# Altium schematic sheet charging.SchDoc: Triumvi - Charging
size Letter; Author: Ye-Sheng Kuo; Revision: 11; SheetNumber: 6; SheetTotal: 10
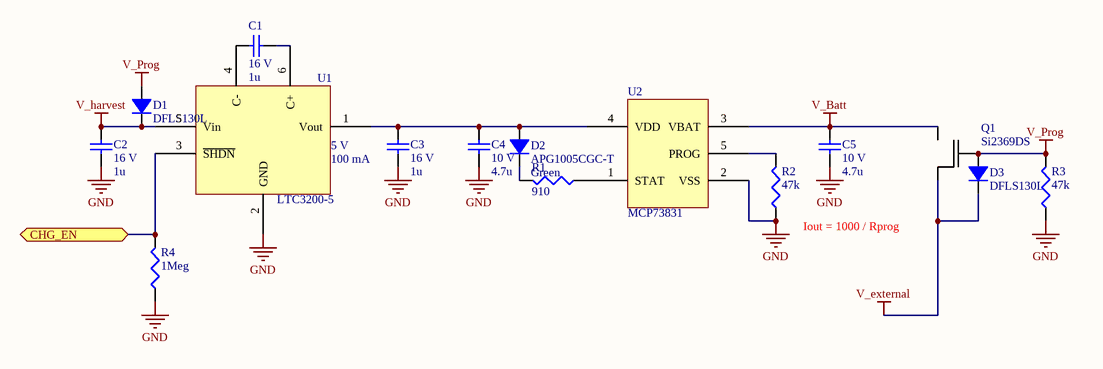
[diagram p0: charging.SchDoc]

## Parts
C1  voltage rated: 16 V  [0603]  (hidden comment: 1u)
C2  voltage rated: 16 V  [0603]  (hidden comment: 1u)
C3  voltage rated: 16 V  [0603]  (hidden comment: 1u)
C4  voltage rated: 10 V  [0603]  (hidden comment: 4.7u)
C5  voltage rated: 10 V  [0603]  (hidden comment: 4.7u)
D1  DFLS130L  [PowerDI123]
D2  APG1005CGC-T  value Green  [0402 - LED]
D3  DFLS130L  [PowerDI123]
Q1  Si2369DS  [SOT23-3]
R1  910  [0402]
R2  47k  [0402]
R3  47k  [0402]
R4  1Meg  [0402]
U1  LTC3200-5  Vout: 5 V  Iout: 100 mA  [SOT23-6]
U2  MCP73831  [TSOT23-5]

## Ports
CHG_EN

## Nets
GND: C2.1 C3.1 C4.2 C5.2 R2.2 R3.2 R4.2 U1.2(GND) U2.2(VSS)
V_Batt: C5.1 Q1.2(S) U2.3(VBAT)
V_external: D3.2 Q1.3(D)
V_harvest: C2.2 D1.2 U1.5(Vin)
V_Prog: D1.1 D3.1 Q1.1(G) R3.1
CHG_EN: R4.1 U1.3(~{SHDN}) ; port CHG_EN
NetC1_1: C1.1 U1.4(C-)
NetC1_2: C1.2 U1.6(C+)
NetC3_2: C3.2 C4.1 D2.1 U1.1(Vout) U2.4(VDD)
NetD2_2: D2.2 R1.1
NetR1_2: R1.2 U2.1(STAT)
NetR2_1: R2.1 U2.5(PROG)

## Notes on the sheet
- (near R2) Iout = 1000 / Rprog
- Title
- Date:
- Author:
- Revision:
- Sheet
- of
- University of Michigan
- File:

## Library data of the parts
C1-C3 = C1608X7R1C105K080AC: 1µF ±10% 16V Ceramic Capacitor X7R 0603; Manufacture: TDK; tolerance: 10%; package: 0603; Temperature Coefficient: X7R; Manufacturer Part Number: C1608X7R1C105K080AC; Supplier 1: Digi-Key; Supplier Part Number 1: 445-1604-1-ND; Value: 1u
C4 C5 = CGB3B1X5R1A475K055AC: 4.7µF ±10% 10V Ceramic Capacitor X5R 0603; Manufacture: TDK; tolerance: 10%; package: 0603; Supplier 1: Digi-Key; Supplier Part Number 1: 445-7482-1-ND; Value: 4.7u; Temperature Coefficient: X5R; Manufacturer Part Number: CGB3B1X5R1A475K055AC
D1 D3 = DFLS130L: 1.0A SURFACE MOUNT SCHOTTKY BARRIER RECTIFIER; Manufacturer: Diodes Incorporated; Forward Voltage @ If: 0.21 V @ 0.1 A; reverse current: 0.26 mA @ 5V; power: 556 mW; Manufacturer Part Number: DFLS130L; diode type: SCHOTTKY BARRIER; Supplier 1: Digi-Key; Supplier Part Number 1: DFLS130LDICT-ND
D2 = APG1005CGC-T: Green 571nm LED Indication - Discrete 2V 0402 (1005 Metric); Manufacturer: Kingbright; Current @ VF: 20 mA; package: 0402; Forward Voltage: 2 V; Manufacturer Part Number: APG1005CGC-T; Wavelength: 571 nm; Supplier 1: Digi-Key; Supplier Part Number 1: 754-1811-1-ND
Q1 = Si2369DS: P-Channel 30-V (D-S) MOSFET; Supplier 1: Digi-Key; Supplier Part Number 1: SI2369DS-T1-GE3CT-ND
R1 = CRCW0402910RFKED: RES SMD 910 OHM 1% 1/16W 0402; Manufacturer: Vishay Dale; Temperature Coefficient: 100 ppm/C; Tolerance: 1%; Power: 1/16 W; package: 0402; Supplier 1: Digi-Key; Supplier Part Number 1: 541-910LCT-ND; value: 910; Manufacturer Part Number: CRCW0402910RFKED
R2 R3 = CRCW040247K0FKED: RES SMD 47K OHM 1% 1/16W 0402; Manufacturer: Vishay Dale; Temperature Coefficient: 100 ppm/C; Tolerance: 1%; Power: 1/16 W; package: 0402; Supplier 1: Digi-Key; Supplier Part Number 1: 541-47.0KLCT-ND; value: 47k; Manufacturer Part Number: CRCW040247K0FKED
R4 = CRCW04021M00FKED: RES SMD 1M OHM 1% 1/16W 0402; Manufacturer: Vishay Dale; Temperature Coefficient: 100 ppm/C; Tolerance: 1%; Power: 1/16 W; Supplier 1: Digi-Key; Supplier Part Number 1: 541-1.00MLCT-ND; package: 0402; value: 1Meg; Manufacturer Part Number: CRCW04021M00FKED
U1 = LTC3200ES6-5#TRMPBF: Low Noise, Regulated   Charge Pump DC/DC Converters; Supplier 1: Digi-Key; Supplier Part Number 1: LTC3200ES6-5#TRMPBFCT-ND
U2 = MCP73831: Miniature Single-Cell, Fully Integrated Li-Ion,  Li-Polymer Charge Management Controllers; Supplier 1: Digi-Key; Supplier Part Number 1: MCP73831T-2ATI/OTCT-ND